# Altium schematic sheet CAN_TRANSCEIVER.SchDoc
size E; SheetNumber: 1; SheetTotal: 1
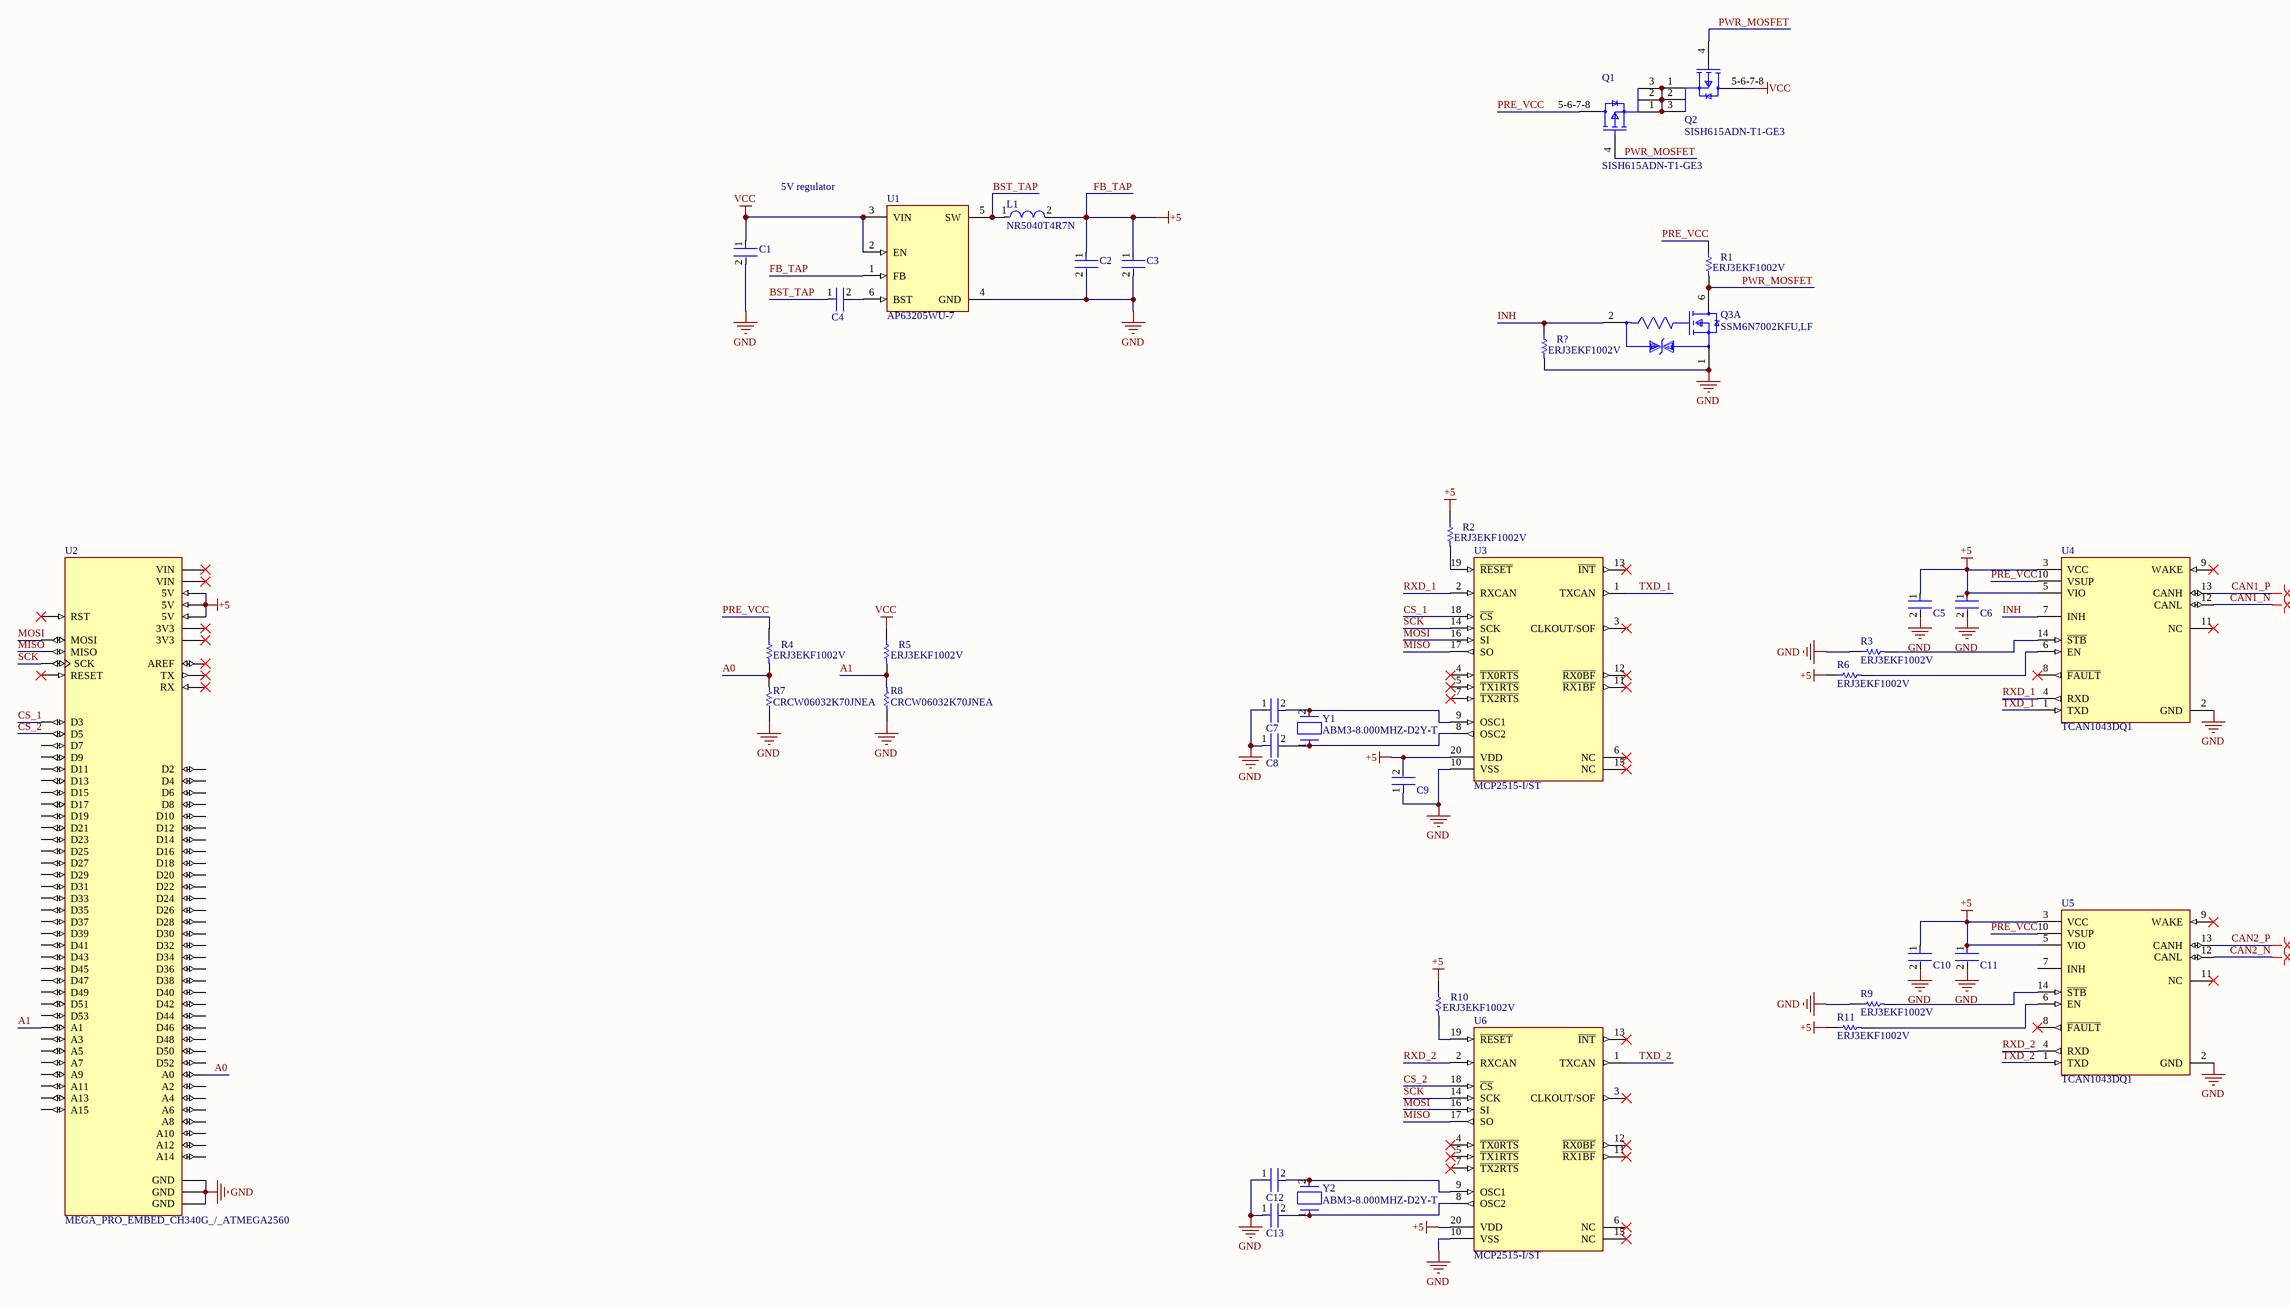
[diagram p0: CAN_TRANSCEIVER.SchDoc]

## Parts
C1  C0805C106K8PACTU  [FP-C0805C-DG-MFG]  (value not drawn)
C2  GRM21BR61E226ME44L  [FP-GRM21B-0_2-e0_2_0_7-IPC_B]  (value not drawn)
C3  GRM21BR61E226ME44L  [FP-GRM21B-0_2-e0_2_0_7-IPC_B]  (value not drawn)
C4  C0402C104K8PACTU  [FP-C0402-BB-MFG]  (value not drawn)
C5  C0402C104K8PACTU  [FP-C0402-BB-MFG]  (value not drawn)
C6  C0402C104K8PACTU  [FP-C0402-BB-MFG]  (value not drawn)
C7  C0805C180J5GACTU  [FP-C0805C-DN-MFG]  (value not drawn)
C8  C0805C180J5GACTU  [FP-C0805C-DN-MFG]  (value not drawn)
C9  C0402C104K8PACTU  [FP-C0402-BB-MFG]  (value not drawn)
C10  C0402C104K8PACTU  [FP-C0402-BB-MFG]  (value not drawn)
C11  C0402C104K8PACTU  [FP-C0402-BB-MFG]  (value not drawn)
C12  C0805C180J5GACTU  [FP-C0805C-DN-MFG]  (value not drawn)
C13  C0805C180J5GACTU  [FP-C0805C-DN-MFG]  (value not drawn)
L1  NR5040T4R7N  [FP-NR5040-H_4_1-MFG]
Q1  SISH615ADN-T1-GE3  [SISH615ADN-T1-GE3-Footprint-1]
Q2  SISH615ADN-T1-GE3  [SISH615ADN-T1-GE3-Footprint-1]
Q3  SSM6N7002KFU,LF  [FP-SSOP6-P-0_65A-MFG]  (part A of 2)
R1  ERJ3EKF1002V  [RESC1609X55X30LL15T15]
R2  ERJ3EKF1002V  [RESC1609X55X30LL15T15]
R3  ERJ3EKF1002V  [RESC1609X55X30LL15T15]
R4  ERJ3EKF1002V  [RESC1609X55X30LL15T15]
R5  ERJ3EKF1002V  [RESC1609X55X30LL15T15]
R6  ERJ3EKF1002V  [RESC1609X55X30LL15T15]
R7  CRCW06032K70JNEA  [RESC1609X50X30ML10T20]
R8  CRCW06032K70JNEA  [RESC1609X50X30ML10T20]
R9  ERJ3EKF1002V  [RESC1609X55X30LL15T15]
R10  ERJ3EKF1002V  [RESC1609X55X30LL15T15]
R11  ERJ3EKF1002V  [RESC1609X55X30LL15T15]
R?  ERJ3EKF1002V  [RESC1609X55X30LL15T15]
U1  AP63205WU-7  [FP-TSOT26-MFG]
U2  MEGA_PRO_EMBED_CH340G_/_ATMEGA2560  [MODULE_MEGA_PRO_EMBED_CH340G_/_ATMEGA2560]
U3  MCP2515-I/ST  [TSSOP-ST20_N]
U4  TCAN1043DQ1  [FP-D0014A-C01-MFG]
U5  TCAN1043DQ1  [FP-D0014A-C01-MFG]
U6  MCP2515-I/ST  [TSSOP-ST20_N]
Y1  ABM3-8.000MHZ-D2Y-T  [FP-ABM3-MFG]
Y2  ABM3-8.000MHZ-D2Y-T  [FP-ABM3-MFG]

## Nets
FB_TAP: C2.1 C3.1 C5.1 C6.1 C9.2 C10.1 C11.1 L1.2 R2.1 R6.1 R10.1 R11.1 U1.1(FB) U2.5V_1(5V) U2.5V_2(5V) U2.5V_3(5V) U3.20(VDD) U4.3(VCC) U4.5(VIO) U5.3(VCC) U5.5(VIO) U6.20(VDD)  [also labelled +5]
GND: C1.2 C2.2 C3.2 C5.2 C6.2 C7.1 C8.1 C9.1 C10.2 C11.2 C12.1 C13.1 Q3.1(Source1) R3.1 R7.1 R8.1 R9.1 R?.2 U1.4(GND) U2.GND_1(GND) U2.GND_2(GND) U2.GND_3(GND) U3.10(VSS) U4.2(GND) U5.2(GND) U6.10(VSS)
VCC: C1.1 Q2.5-6-7-8(D) R5.1 U1.2(EN) U1.3(VIN)
A0: R4.2 R7.2 U2.A0
A1: R5.2 R8.2 U2.A1
BST_TAP: C4.1 L1.1 U1.5(SW)
CAN1_N: U4.12(CANL)
CAN1_P: U4.13(CANH)
CAN2_N: U5.12(CANL)
CAN2_P: U5.13(CANH)
CS_1: U2.D3 U3.18(~{CS})
CS_2: U2.D5 U6.18(~{CS})
INH: Q3.2(Gate1) R?.1 U4.7(INH)
MISO: U2.MISO U3.17(SO) U6.17(SO)
MOSI: U2.MOSI U3.16(SI) U6.16(SI)
PRE_VCC: Q1.5-6-7-8(D) R1.1 R4.1 U4.10(VSUP) U5.10(VSUP)
PWR_MOSFET: Q1.4(G) Q2.4(G) Q3.6(Drain1) R1.2
RXD_1: U3.2(RXCAN) U4.4(RXD)
RXD_2: U5.4(RXD) U6.2(RXCAN)
SCK: U2.SCK U3.14(SCK) U6.14(SCK)
TXD_1: U3.1(TXCAN) U4.1(TXD)
TXD_2: U5.1(TXD) U6.1(TXCAN)
NetC4_2: C4.2 U1.6(BST)
NetC7_2: C7.2 U3.9(OSC1) Y1.2
NetC8_2: C8.2 U3.8(OSC2) Y1.1
NetC12_2: C12.2 U6.9(OSC1) Y2.2
NetC13_2: C13.2 U6.8(OSC2) Y2.1
NetQ1_1: Q1.1(S) Q1.2(S) Q1.3(S) Q2.1(S) Q2.2(S) Q2.3(S)
NetR2_2: R2.2 U3.19(~{RESET})
NetR3_2: R3.2 U4.14(~{STB})
NetR6_2: R6.2 U4.6(EN)
NetR9_2: R9.2 U5.14(~{STB})
NetR10_2: R10.2 U6.19(~{RESET})
NetR11_2: R11.2 U5.6(EN)

Not connected (* = marked no-connect by the designer): U2 3V3_1(3V3)* 3V3_2(3V3)* A2 A3 A4 A5 A6 A7 A8 A9 A10 A11 A12 A13 A14 A15 AREF* D2 D4 D6 D7 D8 D9 D10 D11 D12 D13 D14 D15 D16 D17 D18 D19 D20 D21 D22 D23 D24 D25 D26 D27 D28 D29 D30 D31 D32 D33 D34 D35 D36 D37 D38 D39 D40 D41 D42 D43 D44 D45 D46 D47 D48 D49 D50 D51 D52 D53 RESET* RST* RX* TX* VIN_1(VIN)* VIN_2(VIN)*; U3 3(CLKOUT/SOF)* 4(~{TX0RTS})* 5(~{TX1RTS})* 6(NC)* 7(~{TX2RTS})* 11(~{RX1BF})* 12(~{RX0BF})* 13(~{INT})* 15(NC)*; U4 8(~{FAULT})* 9(WAKE)* 11(NC)*; U5 7(INH) 8(~{FAULT})* 9(WAKE)* 11(NC)*; U6 3(CLKOUT/SOF)* 4(~{TX0RTS})* 5(~{TX1RTS})* 6(NC)* 7(~{TX2RTS})* 11(~{RX1BF})* 12(~{RX0BF})* 13(~{INT})* 15(NC)*

## Layout directives
differential pair: CAN1_N, CAN1_P, CAN2_N, CAN2_P

## Notes on the sheet
- 5V regulator

## Library data of the parts
C1 = CMP-2007-03243-2: CAP CER 10UF 10V X5R 0805; Manufacturer: Kemet; 3DS Part Number: 220-00001; Tolerance: 10%; Temperature Coefficient: 15%; Material: Ceramic; Device Class L2: Capacitors; Device Class L1: Passive Components; ComponentLink2URL: https://content.kemet.com/datasheets/KEM_C1006_X5R_SMD.pdf; Height: 1.4mm; Lead Free: Yes; Manufacturer Part Number: C0805C106K8PACTU; Digikey Description: CAP CER 10UF 10V X5R 0805; Octopart: https://octopart.com/c0805c106k8pactu-kemet-98697; Capacitance: 10uF; Value: 10uF; Temperature Range Low: -55°C; Temperature: -55°C to +85°C; Automotive: No; Mouser Description: CAP CER 10UF 10V X5R 0805; Ipc Land Pattern Name: CAPC200125X125; Temperature Range High: +85°C; Voltage: 10V; RoHS: TRUE; Device Class L3: Ceramic Capacitors; ComponentLink2Description: Datasheet; Voltage Rating: 10V; Package: C0805C-DG; Temperature Characteristic: X5R; Category: Cap
C2 C3 = CMP-2007-03222-3: Chip Multilayer Ceramic Capacitors for General Purpose, 0805, 22uF, X5R, 15%, 20%, 25V; Case/Package: 0805; Depth: 1.25mm; Resistor Type: Ceramic; Voltage Rating: 25V; Lead Free: Lead Free; Voltage Rating (DC): 25V; Case Code (Metric): 2012; Thickness: 0.057inch; REACH SVHC: No SVHC; Material: Ceramic; Tolerance: 20%; Length: 2mm; Capacitance: 22uF; Case Code (Imperial): 0805; Max Operating Temperature: 85°C; Termination: SMD/SMT; Weight: 0.000335oz; Dielectric: X5R; Packaging: Tape and Reel; Voltage: 25V; Package Quantity: 3000; Height: 1.25mm; Mount: Surface Mount; Width: 1.25mm; Min Operating Temperature: -55°C
C4-C6 C9-C11 = CMP-2008-02046-2: CAP CER 0.1UF 10V X5R 0402; Manufacturer: Kemet; Material: Ceramic; Capacitance: 0.10 μF; Temperature Coefficient: 15%; Tolerance: 0.1; Value: 0.10 μF; Package: C0402-BB; Temperature: -55°C to +125°C; ComponentLink2Description: Datasheet; Temperature Characteristic: X5R; Device Class L1: Passive Components; Height: 0.55mm; Lead Free: Yes; ComponentLink2URL: https://content.kemet.com/datasheets/KEM_C1002_X7R_SMD.pdf; Device Class L2: Capacitors; Temperature Range Low: -55°C; Temperature Range High: +125°C; RoHS: TRUE; Octopart: https://octopart.com/c0402c104k8pactu-kemet-140039; Automotive: No; Mouser Description: Capacitor 100 nF 10 VDC 0402; Category: Cap; Voltage Rating: 10 V; Digikey Description: CAP CER 0.1UF 10V X5R 0402; Ipc Land Pattern Name: CAPC10050X50; Device Class L3: Ceramic Capacitors; Manufacturer Part Number: C0402C104K8PACTU
C7 C8 C12 C13 = CMP-2007-00302-2: CAP CER 18PF 50V C0G/NP0 0805; Manufacturer: KEMET; Temperature Characteristic: C0G; Tolerance: 0.05; Material: Ceramic; Temperature Coefficient: 30ppm/°C; Device Class L2: Capacitors; Capacitance: 18 pF; Temperature: -55°C to +125°C; Value: 18 pF; Package: C0805C-DN; Mouser Description: Cap Ceramic 18pF 50V C0G 5% SMD 0805 125C Paper T/R; Height: 0.88mm; ComponentLink2URL: https://content.kemet.com/datasheets/KEM_C1003_C0G_SMD.pdf; RoHS: TRUE; Octopart: https://octopart.com/c0805c180j5gactu-kemet-144810; ComponentLink2Description: Datasheet; Temperature Range High: +125°C; Digikey Description: CAP CER 18PF 50V C0G/NP0 0805; Device Class L1: Passive Components; Category: Cap; Automotive: No; Device Class L3: Ceramic Capacitors; Voltage Rating: 50 V; Temperature Range Low: -55°C; Ipc Land Pattern Name: CAPC200125X78; Lead Free: Yes; Manufacturer Part Number: C0805C180J5GACTU
L1 = CMP-14484-001014-1: SMD Power Inductors 4.7uH ±30% 3.1A 37.7mΩ; Test Frequency: 100kHz; Self Resonant Frequency: 28MHz; DC Resistance (DCR): 37.7mR; Saturation Current: 3.3A; Shielding: Shielded; Core Material: Ferrite; Package Quantity: 1500; RoHS Compliant: Yes; Resistor Type: Wirewound; Width: 4.9mm; Termination: SMD/SMT; Number of Pins: 2; Current Rating: 3.1A; Depth: 5.1mm; RMS Current (Irms): 3.1A; Height - Seated (Max): 0.161inch; Height: 4mm; Packaging: Tape and Reel; Inductance: 4.7uH; Length: 0.193inch; Max DC Current: 3.3A; Inductance Tolerance: 30%; Case/Package: Nonstandard; Series: NR; Min Operating Temperature: -25°C; Max Operating Temperature: 120°C; Mount: Surface Mount; Radiation Hardening: No; Tolerance: 30%; Halogen Free: Halogen Free
Q1 Q2 = CMP-013-00036-1: Trans MOSFET P-CH 20V 22.1A 8-Pin PowerPAK 1212 EP T/R
Q3 = CMP-35916-000009-1: MOSFET 2N-CH 60V 0.3A; Input Capacitance: 40pF; Continuous Drain Current (ID): 300mA; Max Power Dissipation: 285mW; FET Type: 2 N-Channel; Rds On Max: 1.5R; Mount: Surface Mount; Drain to Source Voltage (Vdss): 60V; Packaging: Tape and Reel
R1-R6 R9-R11 R? = CMP-1012-00623-3: Chip Resistor, 10 KOhm, +/- 1%, 0.1 W, -55 to 155 degC, 0603 (1608 Metric), RoHS, Tape and Reel; Manufacturer: Panasonic; Voltage Rating: 75V; Case\/Package: 0603; Power Rating: 100mW; Resistance: 10KOhm; Temperature Coefficient: 100ppm\/degreesC; Number of Pins: 2; Package Reference: 603; Depth: 0.8mm; Mount: SurfaceMount; Package Description: 2-Pin Surface Mount Device, Body 1.6 x 0.85 mm; Datasheet Version: 02/2017; Length: 1.6mm; Lead Free: LeadFree; Height: 0.45mm; Number of Terminations: 2; Max Power Dissipation: 100mW; Min Operating Temperature: -55degC; Datasheet URL: https://industrial.panasonic.com/cdbs/www-data/pdf/RDA0000/AOA0000C304.pdf; Termination: SMD/SMT; Case Code (Metric): 1608; Case Code (Imperial): 0603; Tolerance: 1%; Max Operating Temperature: 155degC; RoHSCompliant: true; Voltage Rating (DC): 75V; Radiation Hardening: No; Packaging: TapeandReel; Composition: ThickFilm; Mounting Technology: SurfaceMount; Manufacturer URL: http://www.panasonic.com/; Width: 0.031inch; REACH SVHC: NoSVHC; Contact Plating: Tin; Military Standard: Not; Package Quantity: 1
R7 R8 = CMP-2000-03183-1: Manufacturer: Vishay Dale; Part Number: CRCW06032K70JNEA
U1 = CMP-12757-000001-1: IC REG BUCK 5V 2A TSOT26; Manufacturer: Diodes Inc.; Max Junction Temp: +160°C; Max Duty Cycle: 100%; Standoff Height: 0.01mm; Max Supply Voltage: 32V; Number Of Outputs: 1; Min Supply Voltage: 3.8V; Output Type: Fixed; Switching Frequency: 1100kHz; Nominal Supply Current: 22uA; Automotive: No; RoHS: TRUE; Switching Topology: Buck; Temperature: -40°C to +85°C; Footprint Url: https://www.diodes.com/assets/Package-Files/TSOT26.pdf; Lead Free: Yes; Digikey Description: IC REG BUCK 5V 2A TSOT26; Device Class L3: Voltage Regulators - Switching; Ambient Temperature Range High: +85°C; Category: IC; Package: TSOT26; Output Voltage: 5V; Output Current: 2A; ComponentLink2Description: Datasheet; Device Class L2: Power Management ICs; Ambient Temperature Range Low: -40°C; Temperature Range High: +85°C; Temperature Range Low: -40°C; Octopart: https://octopart.com/ap63205wu-7-diodes+inc.-98099551; Manufacturer Part Number: AP63205WU-7; Height: 1mm; Device Class L1: Integrated Circuits (ICs); ComponentLink2URL: https://www.diodes.com/assets/Datasheets/AP63200-AP63201-AP63203-AP63205.pdf
U2 = CMP-002-000002-2: Mega 2560 PRO (Embed) CH340G/ATmega2560-16AU; Pin Count: 86; MP: MEGA_PRO_EMBED_CH340G_/_ATMEGA2560; Design Item ID: MEGA_PRO_EMBED_CH340G_/_ATMEGA2560; Price: None; Availability: Unavailable; Source: MEGA_PRO_EMBED_CH340G___ATMEGA2560.SchLib; Package: None; Value: *; Component Type: Standard
U3 U6 = CMP-0186-00077-2: Stand-Alone CAN Controller With SPI Interface, 20-Pin TSSOP, Industrial Temperature; DatasheetVersion: revF, Oct-2010; ComponentLink1Description: Manufacturer URL; PackageDescription: 20-Lead Plastic Thin Shrink Small Outline (ST) - 4.4mm Body [TSSOP]; ComponentLink1URL: http://www.microchip.com/; RevisionNote: URLs added. DatasheetVersion updated.; PackageReference: TSSOP-ST20; Code_JEDEC: MO-153-AC; ComponentLink2Description: Datasheet; ComponentLink2URL: http://ww1.microchip.com/downloads/en/DeviceDoc/21801f.pdf; PackageVersion: revBB, Aug-2009; ComponentLink3URL: http://www.microchip.com/stellent/groups/techpub_sg/documents/packagingspec/en012702.pdf; ComponentLink3Description: Package Specification
U4 U5 = CMP-04872-000219-1: IC TRANSCEIVER 1/1 14SOIC; Data Rate: 2Mbps; Receiver Hysteresis: 50mV; RoHS Compliant: Yes; Min Operating Temperature: -40°C; Case/Package: SOIC; Mount: Surface Mount; Max Operating Temperature: 125°C; Packaging: Rail/Tube
Y1 Y2 = CMP-2000-05033-2: Crystal 8MHz ±20ppm 18pF SMD-2 5mm x 3.2mm; Series Resistance: 500R; Frequency Stability: 30ppm; ESR (Equivalent Series Resistance): 140R; Load Capacitance: 18pF; Height: 0.051inch; Tolerance: 20ppm; Depth: 3.2mm; Max Operating Temperature: 85°C; Frequency: 8MHz; Termination: SMD/SMT; Lead Free: Lead Free; Number of Pins: 2; Width: 3.2mm; RoHS Compliant: Yes; Resistor Type: Ceramic; Length: 5mm; Mount: Surface Mount; Case/Package: CSMD; Package Quantity: 1000; Radiation Hardening: No; Min Operating Temperature: -40°C; Packaging: Tape and Reel; Frequency Tolerance: 20ppm